# EasyEDA schematic Esping.json

## Sheets
1 Esping_Connector: TITLE: Esping_Connector; REV: 1.0; Date: 2024-01-14; Sheet: 1/1; Drawn By: Benedikt Wörmann; Company: Your Company
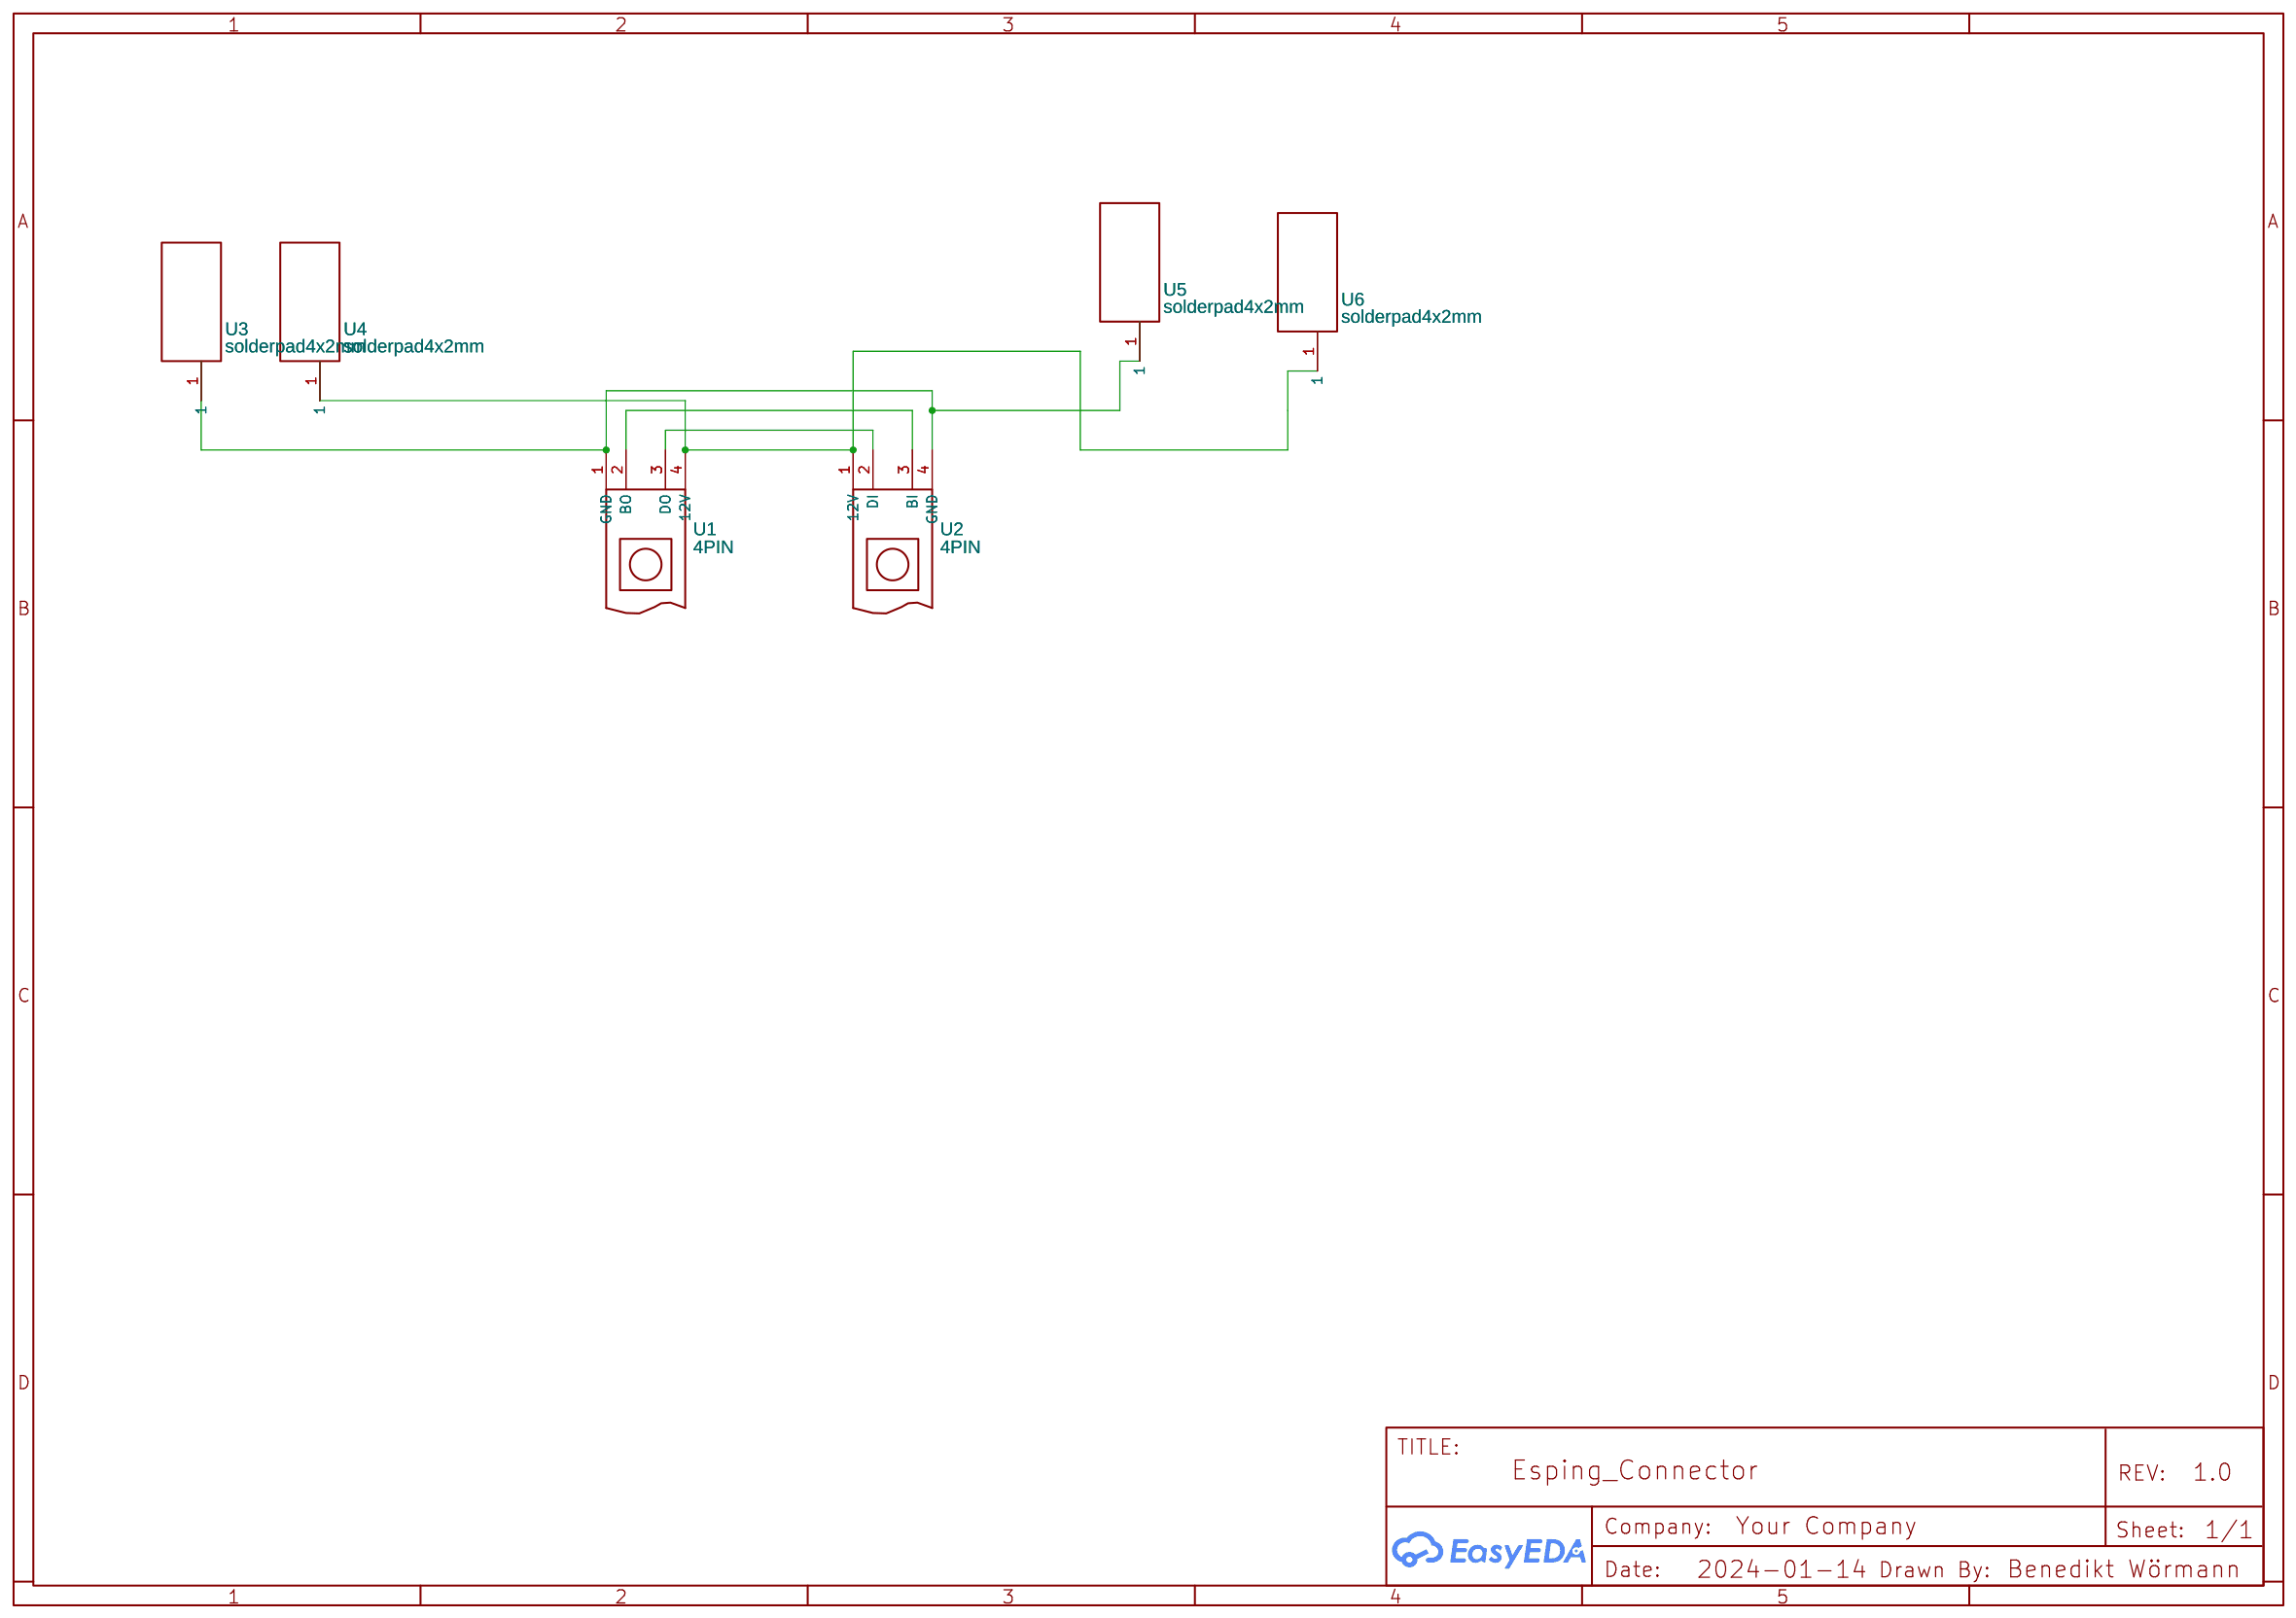
[diagram p0: Esping_Connector]
2 Esping_Mainboard: TITLE: Sheet_1; Date: 2023-12-08
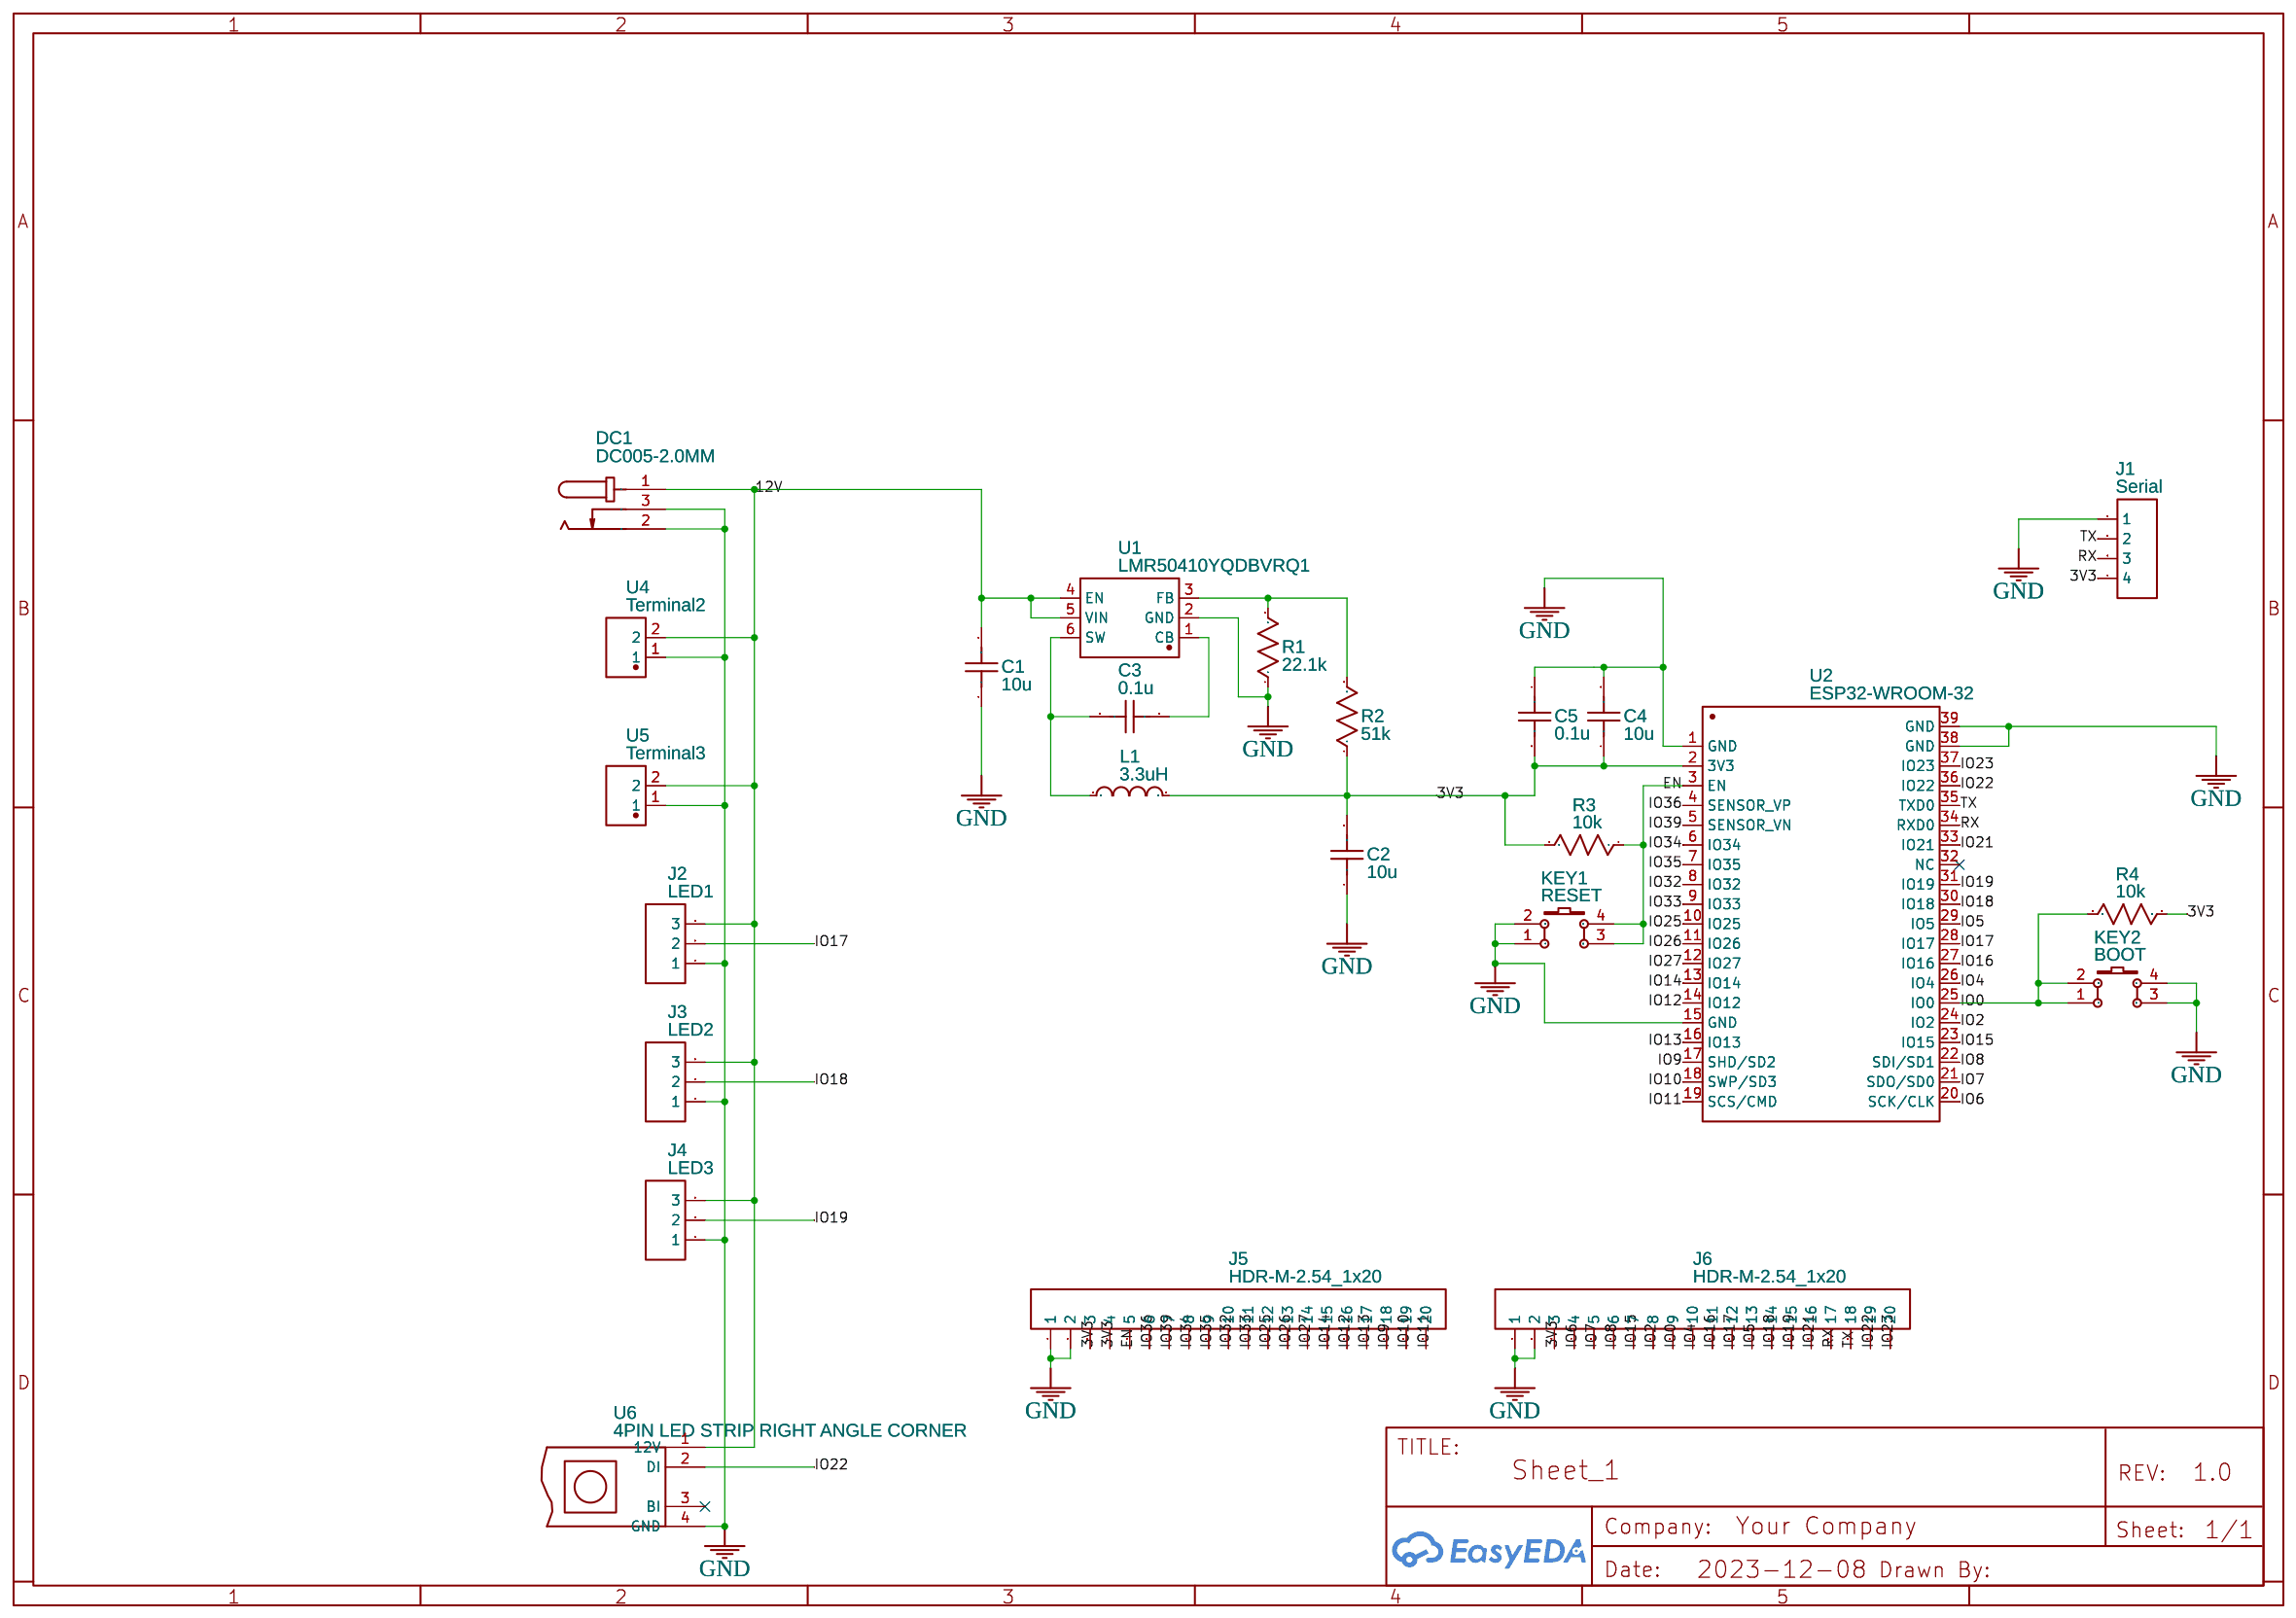
[diagram p1: Esping_Mainboard]

## Parts
sheet Esping_Connector
U1  4PIN  [4PIN-10MM-LED-STRIP]
U2  4PIN  [4PIN-10MM-LED-STRIP]
U3  solderpad4x2mm  [SOLDERPAD 4X2MM]
U4  solderpad4x2mm  [SOLDERPAD 4X2MM]
U5  solderpad4x2mm  [SOLDERPAD 4X2MM]
U6  solderpad4x2mm  [SOLDERPAD 4X2MM]
sheet Esping_Mainboard
C1  10u  [C0603]
C2  10u  [C0603]
C3  0.1u  [C1206]
C4  10u  [C0603]
C5  0.1u  [C1206]
DC1  DC005-2.0MM  [DC-IN-TH_DC005]
J1  Serial  [HDR-M-2.54_1X4]
J2  LED1  [HDR-M-2.54_1X3]
J3  LED2  [HDR-M-2.54_1X3]
J4  LED3  [HDR-M-2.54_1X3]
J5  HDR-M-2.54_1x20  [HDR-M-2.54_1X20]
J6  HDR-M-2.54_1x20  [HDR-M-2.54_1X20]
KEY1  RESET  [KEY-TH_4P-L6.0-W6.0-P4.50-LS6.5]
KEY2  BOOT  [KEY-TH_4P-L6.0-W6.0-P4.50-LS6.5]
L1  3.3uH  [IND-SMD_L4.0-W4.0]
R1  22.1k  [R0603]
R2  51k  [R0603]
R3  10k  [R0603]
R4  10k  [R0603]
U1#2  LMR50410YQDBVRQ1  [SOT-23-6_L2.9-W1.6-P0.95-LS2.8-BR]
U2#2  ESP32-WROOM-32  [WIFIM-SMD_ESP32-WROOM-32-N4]
U4#2  Terminal2  [CONN-TH_2P-P5.0-TB002-500-02BE]
U5#2  Terminal3  [CONN-TH_2P-P5.0-TB002-500-02BE]
U6#2  4PIN LED STRIP RIGHT ANGLE CORNER  [4PIN-10MM-LED-STRIP]

## Library data of the parts
U1 U2 U6#2 = 4PIN LED STRIP RIGHT ANGLE CORNER: Contributor: mattiabasket2004
U3-U6 = solderpad4x2mm: Contributor: Benjamin Fuchs
C1 C2 C4 = C_0603_US: Contributor: LCEDA_Lib
C3 C5 = C_1206_US: Contributor: LCEDA_Lib
DC1 = DC005-2.0MM: Supplier: LCSC; Manufacturer: SOFNG; Supplier Part: C111567
J1 = HDR-M-2.54_1x4: Supplier Part: C124378; Supplier: LCSC; Contributor: LCEDA_Lib
J2-J4 = HDR-M-2.54_1x3: Supplier Part: C180248; Supplier: LCSC; Contributor: LCEDA_Lib
J5 J6 = HDR-M-2.54_1x20: Supplier Part: C50981; Supplier: LCSC; Contributor: LCEDA_Lib
KEY1 KEY2 = K4-6×6_TH: Supplier: LCSC; Supplier Part: C136684; Manufacturer: 韩国韩荣; Manufacturer Part: K2-1102DP-E4SW-04; Contributor: LCEDA_Lib
L1 = YNR4030-3R3M: Contributor: LCSC; Supplier: LCSC; Supplier Part: C340390; Manufacturer: YJYCOIN(益嘉源); JLCPCB Part Class: Extended Part
R1-R4 = R_0603_US: Contributor: LCEDA_Lib
U1#2 = LMR50410YQDBVRQ1: Contributor: lcsc; Supplier: LCSC; Supplier Part: C2877621; Manufacturer: TI(德州仪器); JLCPCB Part Class: Extended Part
U2#2 = ESP32-WROOM-32: Contributor: LCSC; Supplier: LCSC; Supplier Part: C82899; Manufacturer: ESPRESSIF(乐鑫); JLCPCB Part Class: Extended Part
U4#2 U5#2 = TB002-500-02BE: Supplier: LCSC; Manufacturer: null; Contributor: RobinsonNi; JLCPCB Part Class: Extended Part

## Nets
3V3: C2.2 C4.1 C5.2 J1.4 J5.3 J5.4 J6.3 L1.2 R2.1 R3.2 R4.2 U2#2.2(3V3)
12V: C1.2 DC1.1 J2.3 J3.3 J4.3 U1#2.4(EN) U1#2.5(VIN) U4#2.2 U5#2.2 U6#2.1(12V)
GND: C1.1 C2.1 C4.2 C5.1 DC1.2 DC1.3 J1.1 J2.1 J3.1 J4.1 J5.1 J5.2 J6.1 J6.2 KEY1.1 KEY1.2 KEY2.3 KEY2.4 R1.1 U1#2.2(GND) U2#2.1(GND) U2#2.15(GND) U2#2.38(GND) U2#2.39(GND) U4#2.1 U5#2.1 U6#2.4(GND)
EN: J5.5 KEY1.3 KEY1.4 R3.1 U2#2.3(EN)
IO0: J6.9 KEY2.1 KEY2.2 R4.1 U2#2.25(IO0)
IO2: J6.8 U2#2.24(IO2)
IO4: J6.10 U2#2.26(IO4)
IO5: J6.13 U2#2.29(IO5)
IO6: J6.4 U2#2.20(SCK/CLK)
IO7: J6.5 U2#2.21(SDO/SD0)
IO8: J6.6 U2#2.22(SDI/SD1)
IO9: J5.18 U2#2.17(SHD/SD2)
IO10: J5.19 U2#2.18(SWP/SD3)
IO11: J5.20 U2#2.19(SCS/CMD)
IO12: J5.16 U2#2.14(IO12)
IO13: J5.17 U2#2.16(IO13)
IO14: J5.15 U2#2.13(IO14)
IO15: J6.7 U2#2.23(IO15)
IO16: J6.11 U2#2.27(IO16)
IO17: J2.2 J6.12 U2#2.28(IO17)
IO18: J3.2 J6.14 U2#2.30(IO18)
IO19: J4.2 J6.15 U2#2.31(IO19)
IO21: J6.16 U2#2.33(IO21)
IO22: J6.19 U2#2.36(IO22) U6#2.2(DI)
IO23: J6.20 U2#2.37(IO23)
IO25: J5.12 U2#2.10(IO25)
IO26: J5.13 U2#2.11(IO26)
IO27: J5.14 U2#2.12(IO27)
IO32: J5.10 U2#2.8(IO32)
IO33: J5.11 U2#2.9(IO33)
IO34: J5.8 U2#2.6(IO34)
IO35: J5.9 U2#2.7(IO35)
IO36: J5.6 U2#2.4(SENSOR_VP)
IO39: J5.7 U2#2.5(SENSOR_VN)
RX: J1.3 J6.17 U2#2.34(RXD0)
TX: J1.2 J6.18 U2#2.35(TXD0)
Net-(C3-1): C3.1 U1#2.1(CB)
Net-(C3-2): C3.2 L1.1 U1#2.6(SW)
Net-(R1-2): R1.2 R2.2 U1#2.3(FB)
Net-(U1-1): U1.1(GND) U2.4(GND) U3.1 U5.1
Net-(U1-2): U1.2(BO) U2.3(BI)
Net-(U1-3): U1.3(DO) U2.2(DI)
Net-(U1-4): U1.4(12V) U2.1(12V) U4.1 U6.1

Not connected (* = marked no-connect by the designer): U2#2 32(NC)*; U6#2 3(BI)*
